# EAGLE design Test 2019 (EAGLE 9.4.0)
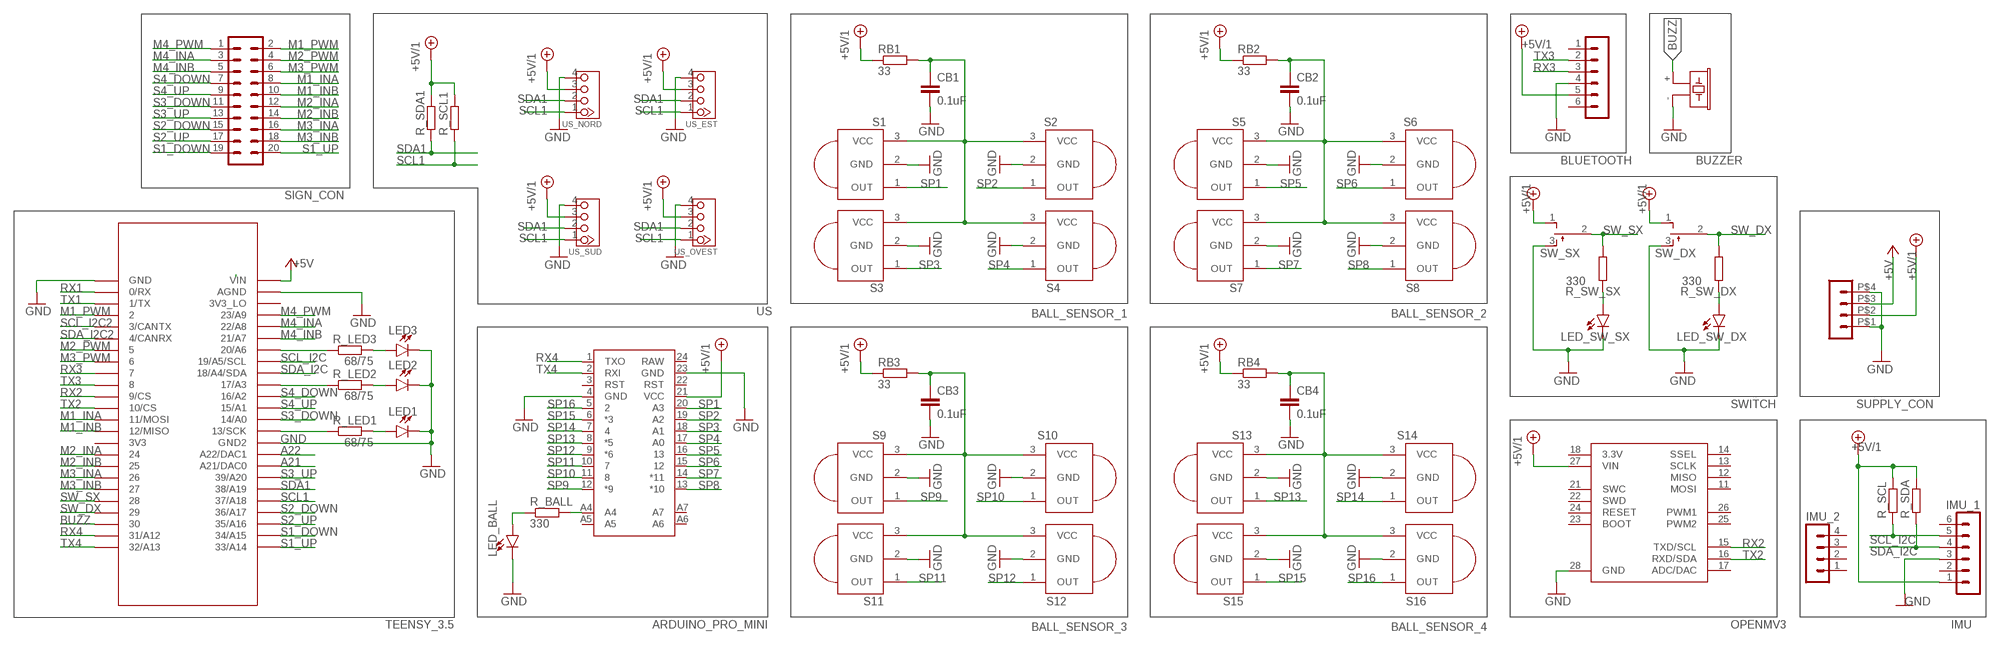
[diagram p0: schematic, sheet 1]

## Parts
ARDUINO_PRO_MINI  ARDUINO_PRO_MINI  [ARDUINO_PRO_MINI]
BLUETOOTH  MA06-1  [MA06-1]
BUZZER  F/CM12P  [F/CM12P]
CB1  0.1uF  C-EUC1206  [C1206]
CB2  0.1uF  C-EUC1206  [C1206]
CB3  0.1uF  C-EUC1206  [C1206]
CB4  0.1uF  C-EUC1206  [C1206]
IMU_1  MA06-1  [MA06-1]
IMU_2  MA04-1  [MA04-1]
LED1  LED3MM  [LED_3MM]
LED2  LED3MM  [LED_3MM]
LED3  LED3MM  [LED_3MM]
LED_BALL  LED3MM  [LED_3MM]
LED_SW_DX  LED3MM  [LED_3MM]
LED_SW_SX  LED3MM  [LED_3MM]
R_BALL  330  R-EU_R1206  [R1206]
R_LED1  68/75  R-EU_R0805  [R0805]
R_LED2  68/75  R-EU_R0805  [R0805]
R_LED3  68/75  R-EU_R0805  [R0805]
R_SCL  3.3k  R-EU_R0805  [R0805]
R_SCL1  3.3k  R-EU_R0805  [R0805]
R_SDA  3.3k  R-EU_R0805  [R0805]
R_SDA1  3.3k  R-EU_R0805  [R0805]
R_SW_DX  330  R-EU_R0805  [R0805]
R_SW_SX  330  R-EU_R0805  [R0805]
RB1  33  R-EU_R0805  [R0805]
RB2  33  R-EU_R0805  [R0805]
RB3  33  R-EU_R0805  [R0805]
RB4  33  R-EU_R0805  [R0805]
S1  PNA460XM  [PNA460XM]
S2  PNA460XM  [PNA460XM]
S3  PNA460XM  [PNA460XM]
S4  PNA460XM  [PNA460XM]
S5  PNA460XM  [PNA460XM]
S6  PNA460XM  [PNA460XM]
S7  PNA460XM  [PNA460XM]
S8  PNA460XM  [PNA460XM]
S9  PNA460XM  [PNA460XM]
S10  PNA460XM  [PNA460XM]
S11  PNA460XM  [PNA460XM]
S12  PNA460XM  [PNA460XM]
S13  PNA460XM  [PNA460XM]
S14  PNA460XM  [PNA460XM]
S15  PNA460XM  [PNA460XM]
S16  PNA460XM  [PNA460XM]
SIGN_CON  20V  [20V]
SUPPLY_CON  HEADER_POS4_43045-0412  [43045-0412]
SW_DX  TL38PO  [TL3XPO]
SW_SX  TL38PO  [TL3XPO]
TEENSY_3.5  TEENSY_3.5/3.6  [TEENSY_3.5/3.6]
U$2  OPENMV3  [OPENMV3]
US_EST  TWIG_2.0  [2.0_1X4]
US_NORD  TWIG_2.0  [2.0_1X4]
US_OVEST  TWIG_2.0  [2.0_1X4]
US_SUD  TWIG_2.0  [2.0_1X4]

## Nets
+5V: SUPPLY_CON.P$3 TEENSY_3.5.VIN
+5V/1: ARDUINO_PRO_MINI.21(VCC) BLUETOOTH.5 IMU_1.1 R_SCL1.2 R_SCL.2 R_SDA1.2 R_SDA.2 RB1.1 RB2.1 RB3.1 RB4.1 SUPPLY_CON.P$2 SW_DX.1(O) SW_SX.1(O) U$2.27(VIN) US_EST.3 US_NORD.3 US_OVEST.3 US_SUD.3
A21: TEENSY_3.5.21/DAC0(A21/DAC0)
A22: TEENSY_3.5.A22/DAC1
BUZZ: BUZZER.+ TEENSY_3.5.30
GND [Power]: ARDUINO_PRO_MINI.4(GND) ARDUINO_PRO_MINI.23(GND) BLUETOOTH.4 BUZZER.- CB1.2 CB2.2 CB3.2 CB4.2 IMU_1.3 LED1.K(C) LED2.K(C) LED3.K(C) LED_BALL.K(C) LED_SW_DX.K(C) LED_SW_SX.K(C) S1.2(GND) S2.2(GND) S3.2(GND) S4.2(GND) S5.2(GND) S6.2(GND) S7.2(GND) S8.2(GND) S9.2(GND) S10.2(GND) S11.2(GND) S12.2(GND) S13.2(GND) S14.2(GND) S15.2(GND) S16.2(GND) SUPPLY_CON.P$1 SUPPLY_CON.P$4 SW_DX.3(S) SW_SX.3(S) TEENSY_3.5.AGND TEENSY_3.5.GND TEENSY_3.5.GND2 U$2.28(GND) US_EST.4 US_NORD.4 US_OVEST.4 US_SUD.4
M1_INA: SIGN_CON.8 TEENSY_3.5.11/MOSI
M1_INB: SIGN_CON.10 TEENSY_3.5.12/MISO
M1_PWM: SIGN_CON.2 TEENSY_3.5.2
M2_INA: SIGN_CON.12 TEENSY_3.5.24
M2_INB: SIGN_CON.14 TEENSY_3.5.25
M2_PWM: SIGN_CON.4 TEENSY_3.5.5
M3_INA: SIGN_CON.16 TEENSY_3.5.26
M3_INB: SIGN_CON.18 TEENSY_3.5.27
M3_PWM: SIGN_CON.6 TEENSY_3.5.6
M4_INA: SIGN_CON.3 TEENSY_3.5.22/A8
M4_INB: SIGN_CON.5 TEENSY_3.5.21/A7
M4_PWM: SIGN_CON.1 TEENSY_3.5.23/A9
N$1: R_LED1.1 TEENSY_3.5.13/SCK
N$2: LED1.A R_LED1.2
N$3: LED_BALL.A R_BALL.1
N$4: ARDUINO_PRO_MINI.A4 R_BALL.2
N$5: LED_SW_SX.A R_SW_SX.1
N$6: LED2.A R_LED2.2
N$7: LED3.A R_LED3.2
N$8: R_LED3.1 TEENSY_3.5.20/A6
N$10: R_LED2.1 TEENSY_3.5.17/A3
N$11: LED_SW_DX.A R_SW_DX.1
POWER_BLOK_1: CB2.1 RB2.2 S5.3(VCC) S6.3(VCC) S7.3(VCC) S8.3(VCC)
POWER_BLOK_2: CB1.1 RB1.2 S1.3(VCC) S2.3(VCC) S3.3(VCC) S4.3(VCC)
POWER_BLOK_3: CB3.1 RB3.2 S9.3(VCC) S10.3(VCC) S11.3(VCC) S12.3(VCC)
POWER_BLOK_4: CB4.1 RB4.2 S13.3(VCC) S14.3(VCC) S15.3(VCC) S16.3(VCC)
RX1: TEENSY_3.5.0/RX
RX2: TEENSY_3.5.9/CS U$2.15(TXD/SCL)
RX3: BLUETOOTH.3 TEENSY_3.5.7
RX4: ARDUINO_PRO_MINI.1(TXO) TEENSY_3.5.31/A12
S1_DOWN: SIGN_CON.19 TEENSY_3.5.34/A15
S1_UP: SIGN_CON.20 TEENSY_3.5.33/A14
S2_DOWN: SIGN_CON.15 TEENSY_3.5.36/A17
S2_UP: SIGN_CON.17 TEENSY_3.5.35/A16
S3_DOWN: SIGN_CON.11 TEENSY_3.5.14/A0
S3_UP: SIGN_CON.13 TEENSY_3.5.39/A20
S4_DOWN: SIGN_CON.7 TEENSY_3.5.16/A2
S4_UP: SIGN_CON.9 TEENSY_3.5.15/A1
SCL1: R_SCL1.1 TEENSY_3.5.37/A18 US_EST.1 US_NORD.1 US_OVEST.1 US_SUD.1
SCL_I2C: IMU_1.5 R_SCL.1 TEENSY_3.5.19/A5/SCL
SCL_I2C2: TEENSY_3.5.3/CANTX
SDA1: R_SDA1.1 TEENSY_3.5.38/A19 US_EST.2 US_NORD.2 US_OVEST.2 US_SUD.2
SDA_I2C: IMU_1.4 R_SDA.1 TEENSY_3.5.18/A4/SDA
SDA_I2C2: TEENSY_3.5.4/CANRX
SP1: ARDUINO_PRO_MINI.20(A3) S1.1(OUT)
SP2: ARDUINO_PRO_MINI.19(A2) S2.1(OUT)
SP3: ARDUINO_PRO_MINI.18(A1) S3.1(OUT)
SP4: ARDUINO_PRO_MINI.17(A0) S4.1(OUT)
SP5: ARDUINO_PRO_MINI.16 S5.1(OUT)
SP6: ARDUINO_PRO_MINI.15 S6.1(OUT)
SP7: ARDUINO_PRO_MINI.14(*11) S7.1(OUT)
SP8: ARDUINO_PRO_MINI.13(*10) S8.1(OUT)
SP9: ARDUINO_PRO_MINI.12(*9) S9.1(OUT)
SP10: ARDUINO_PRO_MINI.11 S10.1(OUT)
SP11: ARDUINO_PRO_MINI.10 S11.1(OUT)
SP12: ARDUINO_PRO_MINI.9(*6) S12.1(OUT)
SP13: ARDUINO_PRO_MINI.8(*5) S13.1(OUT)
SP14: ARDUINO_PRO_MINI.7 S14.1(OUT)
SP15: ARDUINO_PRO_MINI.6(*3) S15.1(OUT)
SP16: ARDUINO_PRO_MINI.5 S16.1(OUT)
SW_DX: R_SW_DX.2 SW_DX.2(P) TEENSY_3.5.29
SW_SX: R_SW_SX.2 SW_SX.2(P) TEENSY_3.5.28
TX1: TEENSY_3.5.1/TX
TX2: TEENSY_3.5.10/CS U$2.16(RXD/SDA)
TX3: BLUETOOTH.2 TEENSY_3.5.8
TX4: ARDUINO_PRO_MINI.2(RXI) TEENSY_3.5.32/A13
Unconnected: ARDUINO_PRO_MINI.3(RST) ARDUINO_PRO_MINI.22(RST) ARDUINO_PRO_MINI.A5 ARDUINO_PRO_MINI.A6 ARDUINO_PRO_MINI.A7 BLUETOOTH.1 BLUETOOTH.6 IMU_1.2 IMU_1.6 IMU_2.1 IMU_2.2 IMU_2.3 IMU_2.4 TEENSY_3.5.3V3 TEENSY_3.5.3V3_LO U$2.11(MOSI) U$2.12(MISO) U$2.13(SCLK) U$2.14(SSEL) U$2.17(ADC/DAC) U$2.18(3.3V) U$2.21(SWC) U$2.22(SWD) U$2.23(BOOT) U$2.24(RESET) U$2.25(PWM2) U$2.26(PWM1)

## Notes on the sheet
- BUZZER
- BALL_SENSOR_1 | BALL_SENSOR_2
- US
- SWITCH
- BALL_SENSOR_3 | BALL_SENSOR_4
- TEENSY_3.5 | IMU

## Power pins joined to a net without a drawn wire
RAW: ARDUINO_PRO_MINI.24(RAW)

## Library data of the parts
ARDUINO_PRO_MINI = SparkFun-Boards:ARDUINO_PRO_MINI: SparkFun Pro Mini Pro Mini compatible footprint. Dimensions: 0.7 x 1.3" PCB Thickness: 0.8mm SparkFun Products: 3.3V/8MHz <https://www.sparkfun.com/products/11114> 5V/16MHz <https://www.sparkfun.com/products/11113>
BLUETOOTH IMU_1 = con-lstb:MA06-1: PIN HEADER; OC_FARNELL: unknown; OC_NEWARK: unknown
BUZZER = buzzer:F/CM12P: BUZZER Source: Buerklin; OC_FARNELL: unknown; OC_NEWARK: unknown
CB1-CB4 = rcl:C-EU: CAPACITOR, European symbol; SPICEPREFIX: C
IMU_2 = con-lstb:MA04-1: PIN HEADER; OC_FARNELL: unknown; OC_NEWARK: unknown
LED1-LED3 LED_BALL LED_SW_DX LED_SW_SX = SparkFun-LED:LED: LED (Generic) Standard schematic elements and footprints for 5mm, 3mm, 1206, and 0603 sized LEDs. Generic LEDs with no color specified.; PROD_ID: DIO-08794
R_BALL R_LED1-R_LED3 R_SCL R_SCL1 R_SDA R_SDA1 R_SW_DX R_SW_SX RB1-RB4 = rcl:R-EU_: RESISTOR, European symbol; SPICEPREFIX: R
S1-S16 = Adafruit:PNA460XM: IR 38KHz receiver PNA4602 and related receivers http://www.ladyada.net/library/pcb/eaglelibrary.html
SIGN_CON = con-harting-v-edit:20V: CONNECTOR; OC_FARNELL: unknown; OC_NEWARK: unknown
SUPPLY_CON = con-molex-micro-fit-3_0:HEADER_POS4_?: Molex - Micro-Fit 3.0 Series connector, 3.00mm (0.118") pitch header, 4 positions.
SW_DX SW_SX = switch:TL38PO: TINY SWITCH ON OFF MOM Source: http://www2.produktinfo.conrad.com/datenblaetter/700000-724999/705152-da-01-de-Subminiaturschalter_TL_36YO.pdf
TEENSY_3.5 = Teensy356:TEENSY_3.5/3.6
U$2 = openmv:OPENMV3
US_EST US_NORD US_OVEST US_SUD = CONNECTER:TWIG_2.0

## Net classes
0 default: width 0.203 mm, clearance 0.254 mm
1 Power: width 0.305 mm, clearance 0.406 mm
2 Power mot: width 1.93 mm

## Board
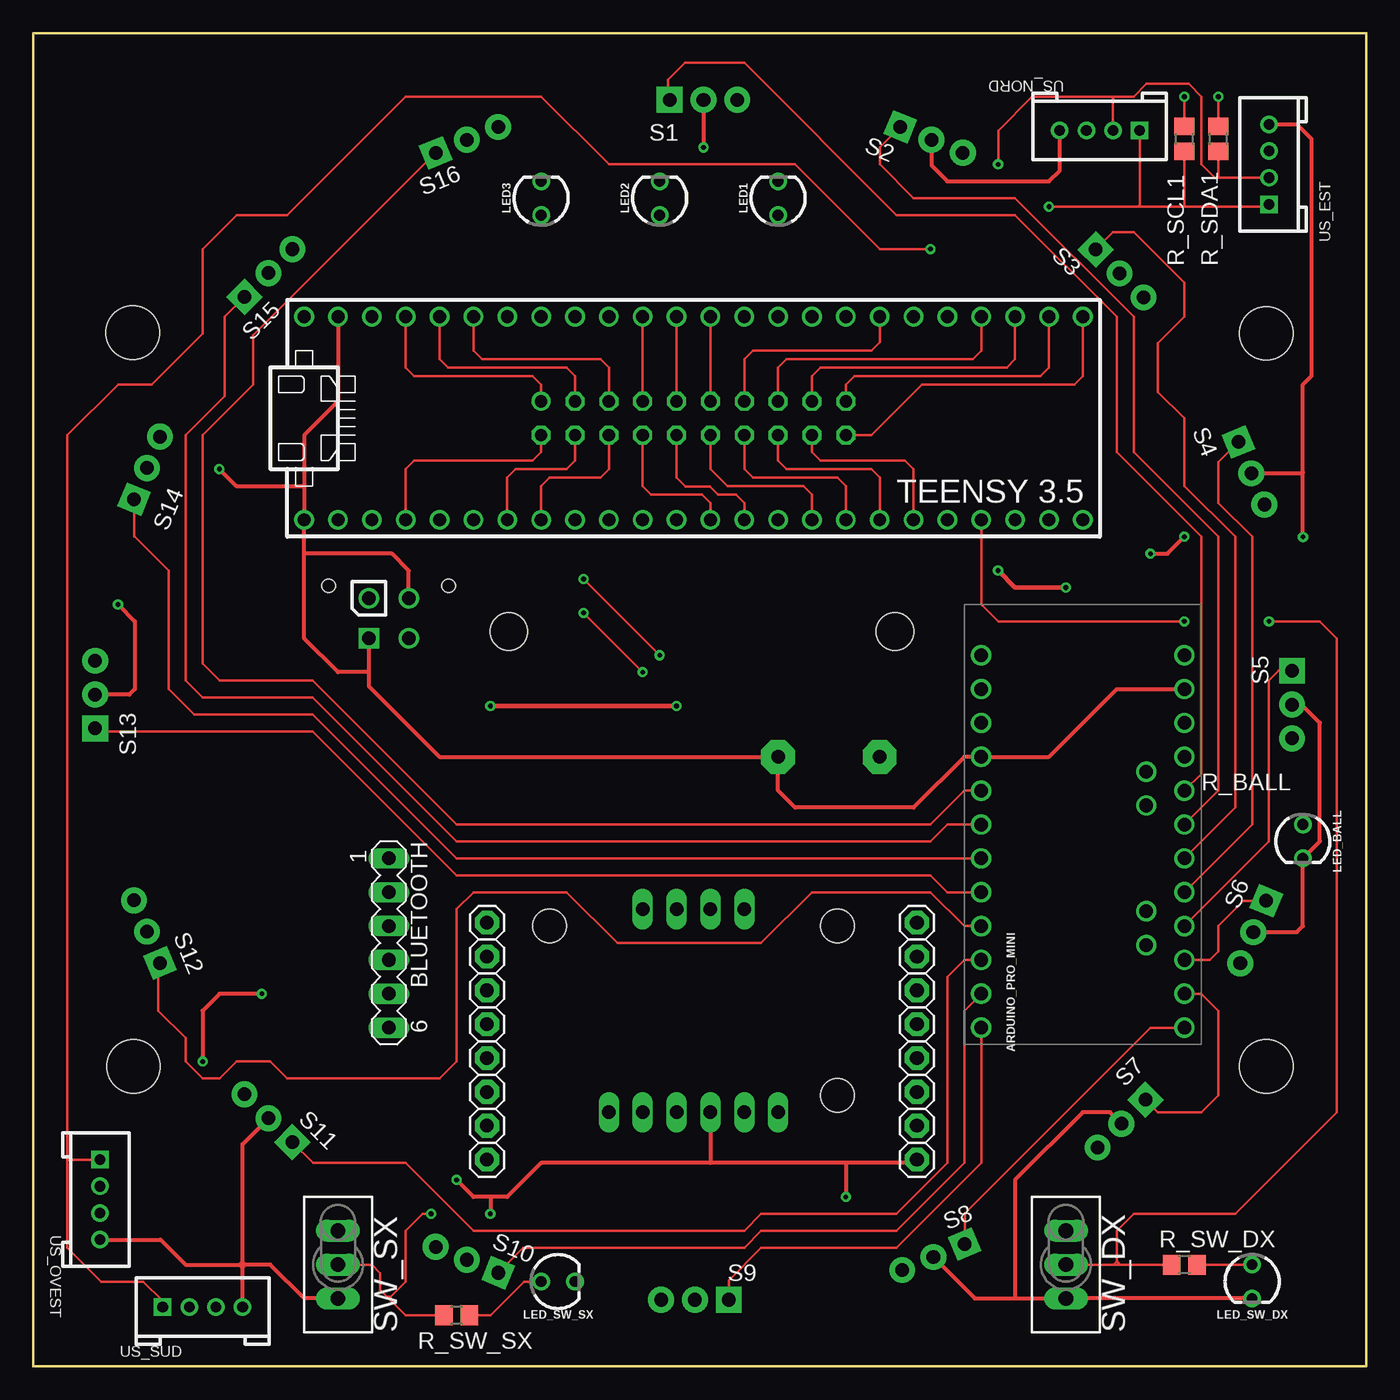
[diagram p1: board, top side]
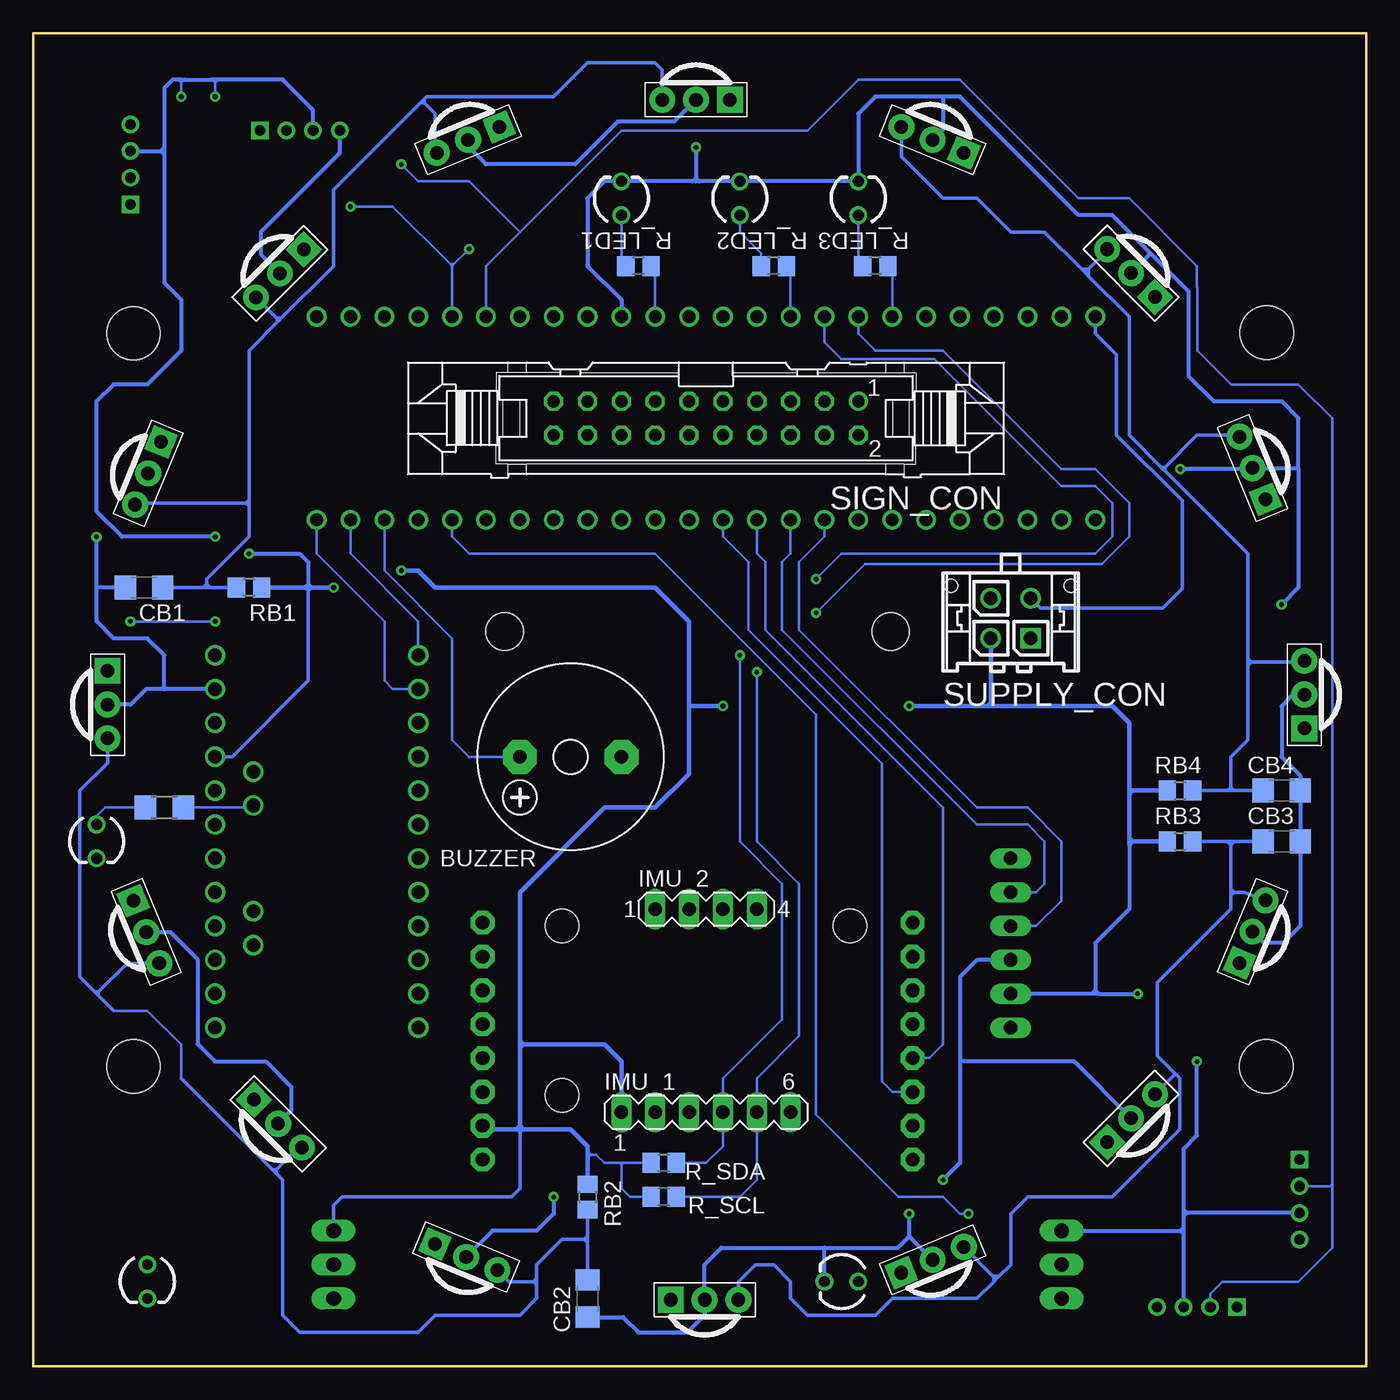
[diagram p2: board, bottom side, seen from below]

Size 100 x 100 mm. Coordinates in mm from the lower left corner, seen from the top.
Outline: 0,0 100,0 100,100 0,100 0,0
Copper layers (1*16): Top 0.035mm / dielectric 1.5mm / Bottom 0.035mm
Design rules "default *": minimum track width 6mil, minimum drill 0.35mm, track to track 5mil, track to pad 7mil, pad to pad 10mil, via to via 10mil, smd to smd 6mil, copper to edge 40mil, drill to drill 6mil, minimum pad ring 10mil, minimum via ring 8mil, stop-mask expansion 4mil, vias tented up to drill 0mil, thermal gap 10mil
Holes 2.8 mm at 64.64,55.12 35.68,55.12
Holes 2.54 mm at 60.33,33.02 38.73,33.02 60.33,20.32
Holes 4 mm at 92.5,77.5 7.46,77.54 92.5,22.5 7.5,22.5

### Footprints (pad centres in the part's own frame; a part is rotated, then mirrored left to right if it is on the bottom)
ARDUINO_PRO_MINI = drill 1.016: 1 -7.62,12.7; 2 -7.62,10.16; 3 -7.62,7.62; 4 -7.62,5.08; 5 -7.62,2.54; 6 -7.62,0; 7 -7.62,-2.54; 8 -7.62,-5.08; 9 -7.62,-7.62; 10 -7.62,-10.16; 11 -7.62,-12.7; 12 -7.62,-15.24; 13 7.62,-15.24; 14 7.62,-12.7; 15 7.62,-10.16; 16 7.62,-7.62; 17 7.62,-5.08; 18 7.62,-2.54; 19 7.62,0; 20 7.62,2.54; 21 7.62,5.08; 22 7.62,7.62; 23 7.62,10.16; 24 7.62,12.7; A4 4.763,1.429; A5 4.763,3.969; A6 4.763,-9.049; A7 4.763,-6.509
MA06-1 = drill 1.016 long: 1 -6.35,0; 2 -3.81,0; 3 -1.27,0; 4 1.27,0; 5 3.81,0; 6 6.35,0
F/CM12P = drill 1.016 pad 2.54 octagon: + 3.81,0; - -3.81,0
C1206 = smd 1.6 x 1.8: 1 -1.4,0; 2 1.4,0
MA04-1 = drill 1.016 long: 1 -3.81,0; 2 -1.27,0; 3 1.27,0; 4 3.81,0
LED_3MM = drill 0.813: A -1.27,0; K 1.27,0
R1206 = smd 1.6 x 1.803: 1 -1.422,0; 2 1.422,0
R0805 = smd 1.3 x 1.5: 1 -0.95,0; 2 0.95,0
PNA460XM = drill 1.016 pad 1.93 square: 1 -2.54,0 | drill 1.016 pad 1.93: 2 0,0; 3 2.54,0
20V = drill 0.914: 1 -11.43,-1.27 | drill 0.914 octagon: 2 -11.43,1.27; 3 -8.89,-1.27; 4 -8.89,1.27; 5 -6.35,-1.27; 6 -6.35,1.27; 7 -3.81,-1.27; 8 -3.81,1.27; 9 -1.27,-1.27; 10 -1.27,1.27; 11 1.27,-1.27; 12 1.27,1.27; 13 3.81,-1.27; 14 3.81,1.27; 15 6.35,-1.27; 16 6.35,1.27; 17 8.89,-1.27; 18 8.89,1.27; 19 11.43,-1.27; 20 11.43,1.27
43045-0412 = drill 1.02 square: P$1 1.5,0 | drill 1.02: P$2 -1.5,0; P$3 1.5,3; P$4 -1.5,3 | hole 1.02: 4.5,3.94; -4.5,3.94
TL3XPO = drill 1.1 pad 1.422 long: 1 -2.54,0; 2 0,0; 3 2.54,0
TEENSY_3.5/3.6 = drill 0.965: 0/RX -25.4,-7.62; 1/TX -22.86,-7.62; 2 -20.32,-7.62; 3/CANTX -17.78,-7.62; 3V3 7.62,-7.62; 3V3_LO -22.86,7.62; 4/CANRX -15.24,-7.62; 5 -12.7,-7.62; 6 -10.16,-7.62; 7 -7.62,-7.62; 8 -5.08,-7.62; 9/CS -2.54,-7.62; 10/CS 0,-7.62; 11/MOSI 2.54,-7.62; 12/MISO 5.08,-7.62; 13/SCK 5.08,7.62; 14/A0 2.54,7.62; 15/A1 0,7.62; 16/A2 -2.54,7.62; 17/A3 -5.08,7.62; 18/A4/SDA -7.62,7.62; 19/A5/SCL -10.16,7.62; 20/A6 -12.7,7.62; 21/A7 -15.24,7.62; 21/DAC0 12.7,7.62; 22/A8 -17.78,7.62; 23/A9 -20.32,7.62; 24 10.16,-7.62; 25 12.7,-7.62; 26 15.24,-7.62; 27 17.78,-7.62; 28 20.32,-7.62; 29 22.86,-7.62; 30 25.4,-7.62; 31/A12 27.94,-7.62; 32/A13 30.48,-7.62; 33/A14 30.48,7.62; 34/A15 27.94,7.62; 35/A16 25.4,7.62; 36/A17 22.86,7.62; 37/A18 20.32,7.62; 38/A19 17.78,7.62; 39/A20 15.24,7.62; A22/DAC1 10.16,7.62; AGND -25.4,7.62; GND -27.94,-7.62; GND2 7.62,7.62; VIN -27.94,7.62
OPENMV3 = drill 1.016 pad 1.778 octagon: 11 1.651,19.304; 12 1.651,16.764; 13 1.651,14.224; 14 1.651,11.684; 15 1.651,9.144; 16 1.651,6.604; 17 1.651,4.064; 18 1.651,1.524; 21 33.909,19.304; 22 33.909,16.764; 23 33.909,14.224; 24 33.909,11.684; 25 33.909,9.144; 26 33.909,6.604; 27 33.909,4.064; 28 33.909,1.524
2.0_1X4 = drill 0.8 pad 1.27 square: 1 -3,0 | drill 0.8 pad 1.27: 2 -1,0; 3 1,0; 4 3,0

### Placement (x,y rotation side)
ARDUINO_PRO_MINI  78.74,40.64 0 top
BLUETOOTH  26.67,31.75 270 top
BUZZER  59.69,45.72 180 bottom
CB1  91.69,58.42 180 bottom
CB2  58.42,5.08 270 bottom
CB3  6.35,39.37 0 bottom
CB4  6.35,43.18 0 bottom
IMU_1  49.53,19.05 0 bottom
IMU_2  49.53,34.29 0 bottom
LED1  55.88,87.63 90 top
LED2  46.99,87.63 90 top
LED3  38.1,87.63 90 top
LED_BALL  95.25,39.37 270 top
LED_SW_DX  91.44,6.35 270 top
LED_SW_SX  39.37,6.35 0 top
R_BALL  90.17,41.91 0 bottom
R_LED1  54.61,82.55 180 bottom
R_LED2  44.45,82.55 180 bottom
R_LED3  36.83,82.55 180 bottom
R_SCL  52.7,12.7 180 bottom
R_SCL1  86.36,92.08 90 top
R_SDA  52.7,15.24 180 bottom
R_SDA1  88.9,92.08 90 top
R_SW_DX  86.36,7.62 180 top
R_SW_SX  31.75,3.81 180 top
RB1  83.82,58.42 180 bottom
RB2  58.42,12.7 270 bottom
RB3  13.97,39.37 0 bottom
RB4  13.97,43.18 0 bottom
S1  50.28,95.01 180 bottom
S2  67.39,92.01 202.5 bottom
S3  81.5,81.99 225 bottom
S4  91.39,66.99 247.5 bottom
S5  94.43,49.64 270 bottom
S6  91.53,32.57 292.5 bottom
S7  81.64,18.19 315 bottom
S8  67.53,8.19 337.5 bottom
S9  49.64,4.98 0 bottom
S10  32.53,7.98 22.5 bottom
S11  17.64,18.6 45 bottom
S12  8.53,32.6 67.5 bottom
S13  4.64,50.39 90 bottom
S14  8.53,67.39 112.5 bottom
S15  17.64,82.01 135 bottom
S16  32.53,92.01 157.5 bottom
SIGN_CON  49.53,71.12 180 bottom
SUPPLY_CON  26.67,54.61 0 bottom
SW_DX  77.47,7.62 270 top
SW_SX  22.86,7.62 270 top
TEENSY_3.5  48.26,71.12 0 top
U$2  32.38,13.97 0 top
US_EST  92.71,90.17 90 top
US_NORD  80.01,92.71 180 top
US_OVEST  5,12.5 270 top
US_SUD  12.7,4.45 0 top

### Tracks (layer width: path | path; a pad name or v marks a point on that pad's centre or on a via)
+5V
  Bottom 0.254: TEENSY_3.5.VIN 20.32,77.47 18.73,75.88 18.73,69.85 13.81,64.93 13.81,58.33 15.24,56.9 24.46,56.9 SUPPLY_CON.P$3
+5V/1  (via drill 0.35)
  Top 0.203: v88.9,95.25 R_SDA1.2 | R_SCL1.2 v86.36,95.25
  Top 0.305: v83.82,60.96 85.09,60.96 v86.36,62.23 | v17.14,27.94 13.97,27.94 12.7,26.67 v12.7,22.86
  Top 0.356: v72.39,59.69 73.66,58.42 v77.47,58.42 | v34.29,49.53 v48.26,49.53
  Bottom 0.203: 58.17,15.88 57.78,15.88 57.15,15.24 56.01,15.24 | 58.42,15.88 58.17,15.88 | R_SDA.2 55.75,15.24 | 55.75,15.24 55.88,15.24 | 55.88,15.24 56.01,15.24 | 58.17,15.88 58.42,16.13 | 58.17,15.88 58.29,15.75 58.42,15.75 | 55.88,15.24 55.88,15.11 | 55.88,15.11 55.88,13.34 55.24,12.7 R_SCL.2 | 55.75,15.24 55.88,15.11 | 55.88,15.11 56.01,15.24 | v88.9,95.25 88.9,96.27 | 88.9,96.27 88.9,96.52 | v86.36,95.25 86.36,96.27 | 86.36,96.52 86.36,96.27 | 85.98,96.52 86.11,96.52 86.36,96.27 | 86.36,96.27 86.61,96.52 | 88.65,96.52 88.9,96.27 | 88.9,96.27 89.15,96.52
  Bottom 0.254: ARDUINO_PRO_MINI.21 85.09,45.72 79.38,51.44 79.38,58.17 | 79.38,58.17 79.38,58.42 79.38,58.67 | 79.38,58.17 79.25,58.29 79.25,58.42 79.25,58.55 | 79.38,58.17 79.5,58.29 79.5,58.42 79.5,58.55 | 17.78,45.72 17.78,43.43 | 17.78,43.18 17.78,43.43 | 17.53,43.18 17.78,43.43 | SW_DX.1 77.47,12.06 76.83,12.7 64.14,12.7 63.5,13.34 63.5,17.53 | 63.5,17.78 63.5,17.53 | 63.25,17.78 63.5,17.53 | 63.5,17.53 63.75,17.78
  Bottom 0.305: v83.82,60.96 80.01,60.96 79.38,60.33 79.38,58.67 | 79.38,58.67 79.25,58.55 | 79.38,58.67 79.5,58.55 | 17.78,39.37 17.78,34.29 20.32,31.75 20.32,28.19 | 20.32,27.94 20.32,28.19 | 20.07,27.94 20.32,27.94 | 20.32,27.94 20.57,27.94 | 20.57,27.94 BLUETOOTH.5 | 20.07,27.94 20.32,28.19 | 20.32,28.19 20.57,27.94 | v86.36,62.23 93.34,62.23 95.25,64.14 95.25,72.39 93.98,73.66 91.44,73.66 88.9,76.2 88.9,80.01 90.17,81.28 90.17,90.93 | US_NORD.3 79.01,94.25 81.28,96.52 85.98,96.52 86.36,96.52 86.61,96.52 88.65,96.52 88.9,96.52 89.15,96.52 89.53,96.52 90.17,95.89 90.17,91.44 | 90.17,91.44 90.17,91.19 | 90.17,91.19 90.17,90.93 | US_EST.3 90.42,91.17 | 90.41,91.17 90.19,91.17 90.17,91.19 | 90.17,91.44 90.42,91.19 90.42,91.17 | 90.17,90.93 90.41,91.17 | 90.41,91.17 90.42,91.17 | v12.7,22.86 12.7,17.31 13.7,16.31 13.7,11.74 | 20.07,27.94 v17.14,27.94 | US_SUD.3 13.7,9.91 | 13.7,9.91 13.7,10.16 | 13.7,10.16 13.7,10.41 | 13.7,10.41 13.7,11.3 | 13.7,11.3 13.7,11.43 | 13.7,11.43 13.7,11.74 | US_OVEST.3 13.46,11.5 | 13.46,11.5 13.63,11.5 13.7,11.43 | 13.7,11.74 13.46,11.5 | 13.46,11.5 13.66,11.3 13.7,11.3 | SW_SX.1 13.95,10.16 | 13.95,10.16 13.7,10.16 | 13.7,10.41 13.95,10.16 | 13.95,10.16 13.7,9.91
  Bottom 0.356: 17.78,43.18 17.53,43.18 | 17.53,43.18 RB4.1 | 17.78,39.37 17.78,39.12 17.53,39.37 | 17.78,39.37 17.78,39.62 | 17.78,39.62 17.78,42.93 | 17.78,43.18 17.78,42.93 | 17.53,39.37 17.78,39.37 | 17.53,39.37 RB3.1 | 17.78,42.93 17.53,43.18 | 17.53,39.37 17.78,39.62 | 63.5,24.38 63.5,24.13 | 63.5,24.13 63.5,23.88 | IMU_1.1 55.88,22.86 57.15,24.13 63.25,24.13 | 63.5,24.13 63.25,24.13 | 63.25,24.13 63.5,24.38 | 63.25,24.13 63.5,23.88 | 50.8,49.53 50.8,55.88 53.34,58.42 69.85,58.42 71.12,59.69 v72.39,59.69 | 50.8,49.53 50.8,44.45 53.34,41.91 57.15,41.91 63.5,35.56 63.5,24.38 | SUPPLY_CON.P$2 28.17,49.76 | 28.17,49.76 28.17,49.53 | v77.47,58.42 79.25,58.42 79.38,58.42 79.5,58.42 RB1.1 | RB2.1 58.42,15.75 58.42,15.88 58.42,16.13 58.42,16.51 59.69,17.78 63.25,17.78 | 63.5,17.78 63.25,17.78 | 63.5,17.78 63.75,17.78 | 63.75,17.78 66.04,17.78 U$2.27 | 63.5,23.88 63.5,18.03 | 63.5,17.78 63.5,18.03 | 63.5,18.03 63.25,17.78 | 63.5,18.03 63.75,17.78 | 17.78,43.18 17.78,45.72 17.78,48.26 19.05,49.53 27.94,49.53 | 28.17,49.53 27.94,49.53 | 28.4,49.53 28.17,49.53 | 28.17,49.76 27.94,49.53 | 28.17,49.76 28.4,49.53 | 28.4,49.53 v34.29,49.53 | 50.8,49.53 v48.26,49.53
BUZZ
  Bottom 0.203: TEENSY_3.5.30 73.66,59.69 68.58,54.61 68.58,46.99 67.31,45.72 BUZZER.+
GND  (via drill 0.35)
  Top 0.305: SUPPLY_CON.P$4 28.17,59.69 26.9,60.96 20.32,60.96 | TEENSY_3.5.AGND 22.86,72.39 20.32,69.85 20.32,66.04 | 20.32,66.04 TEENSY_3.5.GND 20.32,60.96 | v13.95,67.31 15.22,66.04 20.32,66.04 | S1.2 v50.28,91.44 | S2.2 67.39,90.09 68.58,88.9 76.2,88.9 77.01,89.71 US_NORD.4 | v6.35,57.15 7.62,55.88 7.62,50.8 7.21,50.39 S13.2 | v31.75,13.97 33.02,12.7 34.29,12.7 | IMU_1.3 50.8,15.24 | 34.29,12.7 35.56,12.7 38.1,15.24 50.8,15.24 | U$2.28 66.04,15.24 60.96,15.24 | 60.96,15.24 50.8,15.24 | 34.29,12.7 v34.29,11.43 | S7.2 80.78,19.05 78.74,19.05 73.66,13.97 73.66,5.08 | 73.66,5.08 SW_DX.3 LED_SW_DX.K | S8.2 70.64,5.08 73.66,5.08 | ARDUINO_PRO_MINI.23 81.28,50.8 76.2,45.72 ARDUINO_PRO_MINI.4 69.85,45.72 66.04,41.91 57.15,41.91 55.88,43.18 BUZZER.- 30.48,45.72 25.17,51.03 25.17,52.07 | SUPPLY_CON.P$1 25.17,52.07 | 60.96,15.24 v60.96,12.7 | 25.17,52.07 22.86,52.07 20.32,54.61 20.32,60.96 | S6.2 94.8,32.57 95.25,33.02 LED_BALL.K 96.52,39.37 96.52,48.26 95.14,49.64 S5.2 | v95.26,62.22 v95.25,62.23 95.25,67.06 | S4.2 95.18,66.99 95.25,67.06 | US_EST.4 94.79,93.17 95.89,92.08 95.89,74.3 95.25,73.66 95.25,67.06 | US_SUD.4 15.7,7.49 | 15.7,7.49 15.7,7.62 | 15.7,7.62 15.7,7.75 | 15.7,7.75 15.7,16.66 S11.2 | SW_SX.3 20.32,5.08 17.78,7.62 15.88,7.62 | 15.7,7.62 15.88,7.62 | US_OVEST.4 9.55,9.5 11.43,7.62 15.49,7.62 | 15.7,7.62 15.49,7.62 | 15.49,7.62 15.62,7.75 15.7,7.75 | 15.49,7.62 15.62,7.49 15.7,7.49 | 15.88,7.62 15.75,7.75 15.7,7.75 | 15.7,7.49 15.75,7.49 15.88,7.62
  Bottom 0.305: v13.95,67.31 8.61,67.31 S14.2 5.16,67.39 5.08,67.31 | 31.75,95.25 30.48,95.25 21.59,86.36 19.05,86.36 16.26,83.57 | 31.75,95.25 36.83,95.25 38.1,93.98 LED3.K LED2.K 50.04,88.9 | 50.04,88.9 50.29,88.9 | 50.29,88.9 50.52,88.9 | 50.52,88.9 LED1.K 57.15,88.9 58.42,87.63 58.42,82.55 55.88,80.01 TEENSY_3.5.GND2 | S16.2 31.75,92.79 31.75,95.25 | v50.28,91.44 50.28,89.14 | 50.28,89.14 50.28,88.91 50.29,88.9 | 50.04,88.9 50.28,89.14 | 50.28,89.14 50.52,88.9 | S1.2 51.92,93.37 56.15,93.37 59.35,90.17 66.04,90.17 67.39,91.52 S2.2 | v6.35,57.15 5.08,58.42 5.08,67.31 | BLUETOOTH.4 29.21,30.48 30.48,29.21 30.48,22.86 | S11.2 21.9,22.86 30.48,22.86 | v31.75,13.97 30.48,15.24 30.48,22.86 | v34.29,11.43 34.29,9.74 | S10.2 34.18,9.63 | 34.18,9.63 34.29,9.74 | 34.29,9.74 34.4,9.63 | 34.18,9.63 34.4,9.63 | 40.64,8.89 48.37,8.89 49.64,7.62 S9.2 49.64,3.81 50.91,2.54 54.61,2.54 55.75,3.68 CB2.2 | 40.64,8.89 35.14,8.89 34.4,9.63 | LED_SW_SX.K 40.64,8.89 | S5.2 92.71,49.64 91.55,50.8 90.17,50.8 | v60.96,12.7 60.96,11.43 62.23,10.16 65.56,10.16 S8.2 | S6.2 89.72,32.57 87.68,30.53 87.68,24.18 86.36,22.86 82.55,22.86 80.64,20.95 80.64,19.18 S7.2 | ARDUINO_PRO_MINI.23 90.17,50.8 | 90.17,50.8 90.17,53.34 91.44,54.61 93.98,54.61 95.26,55.89 95.26,58.42 | 95.26,58.42 v95.26,62.22 | CB1.2 95.26,58.42 | S3.2 82.94,83.43 82.94,85.09 77.01,91.02 US_NORD.4 | 5.08,67.31 5.08,71.12 6.35,72.39 11.43,72.39 13.34,74.3 13.34,80.64 16.26,83.57 | S15.2 16.26,83.39 16.26,83.57 | S13.2 5.49,50.39 6.35,49.53 6.35,45.72 4.95,44.32 CB4.2 CB3.2 4.95,33.02 6.22,31.75 7.68,31.75 S12.2
M1_INA
  Top 0.203: SIGN_CON.8 45.72,66.04 46.35,65.41 50.16,65.41 50.8,64.77 TEENSY_3.5.11/MOSI
M1_INB
  Top 0.203: TEENSY_3.5.12/MISO 53.34,64.77 52.7,65.41 51.35,65.41 50.76,66 48.94,66 48.26,66.67 SIGN_CON.10
M1_PWM
  Top 0.203: SIGN_CON.2 38.1,68.58 37.47,67.94 28.57,67.94 27.94,67.31 TEENSY_3.5.2
M2_INA
  Top 0.203: SIGN_CON.12 50.8,67.31 52.07,66.04 57.78,66.04 58.42,65.41 TEENSY_3.5.24
M2_INB
  Top 0.203: SIGN_CON.14 53.34,67.31 53.98,66.67 60.33,66.67 60.96,66.04 TEENSY_3.5.25
M2_PWM
  Top 0.203: TEENSY_3.5.5 35.56,66.67 36.2,67.31 40.01,67.31 40.64,67.94 SIGN_CON.4
M3_INA
  Top 0.203: SIGN_CON.16 55.88,67.94 56.52,67.31 62.87,67.31 63.5,66.67 TEENSY_3.5.26
M3_INB
  Top 0.203: SIGN_CON.18 58.42,68.58 59.05,67.94 64.77,67.94 65.41,67.94 66.04,67.31 TEENSY_3.5.27
M3_PWM
  Top 0.203: SIGN_CON.6 43.18,67.31 42.55,66.67 38.73,66.67 38.1,66.04 TEENSY_3.5.6
M4_INA
  Top 0.203: TEENSY_3.5.22/A8 30.48,75.56 31.11,74.93 40.01,74.93 40.64,74.3 SIGN_CON.3
M4_INB
  Top 0.203: TEENSY_3.5.21/A7 33.02,76.2 33.66,75.56 42.55,75.56 43.18,74.93 SIGN_CON.5
M4_PWM
  Top 0.203: SIGN_CON.1 38.1,73.66 37.47,74.3 28.57,74.3 27.94,74.93 TEENSY_3.5.23/A9
N$1
  Bottom 0.203: TEENSY_3.5.13/SCK 53.34,82.23 R_LED1.1
N$2
  Bottom 0.203: LED1.A 55.88,82.87 R_LED1.2
N$3
  Bottom 0.203: R_BALL.1 94.61,41.91 95.25,41.27 LED_BALL.A
N$4
  Bottom 0.203: R_BALL.2 83.66,41.91 ARDUINO_PRO_MINI.A4
N$5
  Top 0.203: LED_SW_SX.A 36.83,6.35 34.29,3.81 R_SW_SX.1
N$6
  Bottom 0.203: LED2.A 46.99,85.09 45.4,83.5 R_LED2.2
N$7
  Bottom 0.203: LED3.A 38.1,82.87 R_LED3.2
N$8
  Bottom 0.203: TEENSY_3.5.20/A6 35.56,82.23 R_LED3.1
N$10
  Bottom 0.203: TEENSY_3.5.17/A3 43.18,82.23 R_LED2.1
N$11
  Top 0.203: R_SW_DX.1 LED_SW_DX.A
POWER_BLOK_1
  Bottom 0.203: 93.98,26.67 91.44,26.67 88.9,24.13 88.9,21.59
  Bottom 0.254: RB2.2 58.42,9.78 | 58.42,9.78 58.42,9.53 | 58.42,9.53 58.42,9.27 | 58.42,9.27 CB2.1 | S5.3 94.43,45.27 96.52,43.18 96.52,29.21 95.38,28.07 | 62.23,6.1 62.23,5.08 63.5,3.81 69.85,3.81 71.12,2.54 80.01,2.54 81.28,3.81 81.28,13.97 81.79,14.48 | 62.23,6.1 62.23,6.35 | 62.23,6.35 62.23,6.6 | 62.23,6.6 62.23,7.62 60.33,9.53 58.67,9.53 | 95.38,28.07 95.25,27.94 | 95.25,27.94 95.12,27.81 | 95.12,27.81 93.98,26.67 | 88.9,21.59 82.04,14.73 | 82.04,14.73 81.92,14.61 | 81.92,14.61 81.79,14.48 | 58.42,9.53 58.67,9.53 | 58.67,9.53 58.42,9.27 | 58.67,9.53 58.42,9.78 | S8.3 64.31,6.35 62.48,6.35 | 62.23,6.35 62.48,6.35 | 62.48,6.35 62.23,6.6 | 62.48,6.35 62.23,6.1 | 81.92,14.61 81.79,14.73 | 81.79,14.73 80.13,16.39 S7.3 | 81.79,14.73 81.79,14.48 | 81.79,14.73 82.04,14.73 | S6.3 92.97,30.22 95.12,28.07 | 95.12,28.07 95.25,27.94 | 95.38,28.07 95.12,28.07 | 95.12,28.07 95.12,27.81
POWER_BLOK_2
  Bottom 0.254: RB1.2 86.74,58.42 | 86.74,58.42 87,58.42 | 87,58.42 87.25,58.42 | 87.25,58.42 CB1.1 | S1.3 52.82,97.27 53.34,97.79 58.42,97.79 60.96,95.25 70.48,95.25 70.67,95.06 | S2.3 69.85,91.15 69.85,93.98 70.67,94.81 | 83.82,64.52 83.82,62.23 87,59.05 87,58.67 | 83.82,64.52 83.82,64.77 | 83.82,65.02 83.82,76.2 81.69,78.33 | 83.82,65.02 83.82,64.77 | S4.3 92.23,64.77 84.07,64.77 | 83.82,64.77 84.07,64.77 | 84.07,64.77 83.82,65.02 | 84.07,64.77 83.82,64.52 | 70.67,95.06 70.8,94.93 | 70.93,94.81 70.8,94.93 | 70.8,94.93 70.67,94.81 | 70.93,94.81 70.67,94.81 | 70.67,95.06 70.67,94.81 | 87,58.42 87,58.67 | 87,58.67 86.74,58.42 | 87,58.67 87.25,58.42 | 81.41,78.61 77.47,82.55 77.47,88.27 70.93,94.81 | 81.41,78.61 81.53,78.49 | 81.53,78.49 81.69,78.33 | S3.3 81.69,78.59 | 81.69,78.59 81.59,78.49 81.53,78.49 | 81.69,78.59 81.69,78.33 | 81.69,78.59 81.66,78.61 81.41,78.61
POWER_BLOK_3
  Bottom 0.254: RB3.2 10.41,39.37 | 10.41,39.37 10.16,39.37 | 10.16,39.37 9.91,39.37 | 9.91,39.37 CB3.1 | 10.16,39.37 10.16,39.12 | 10.16,35.31 10.16,34.29 15.24,29.21 15.67,28.78 15.67,23.29 15.24,22.86 14.4,22.02 | 10.16,35.31 10.16,35.56 | 10.16,35.56 10.16,35.81 | 10.16,35.81 10.16,39.12 | S9.3 47.1,6.35 45.83,7.62 44.45,7.62 43.18,6.35 43.18,5.08 41.91,3.81 36.83,3.81 35.56,5.08 29.21,5.08 27.94,6.35 | 9.91,39.37 10.16,39.12 | 10.16,39.12 10.41,39.37 | S12.3 9.14,35.56 9.91,35.56 | 10.16,35.56 9.91,35.56 | 9.91,35.56 10.16,35.81 | 9.91,35.56 10.16,35.31 | 27.56,6.73 26.67,7.62 26.67,11.43 25.4,12.7 19.05,12.7 13.97,17.78 13.97,21.59 14.22,21.84 | 27.56,6.73 27.75,6.54 | 27.75,6.54 27.94,6.35 | S10.3 27.95,6.72 | 27.94,6.71 27.77,6.54 27.75,6.54 | 27.56,6.73 27.94,6.73 27.95,6.72 | 27.94,6.35 27.94,6.71 | 27.94,6.71 27.95,6.72 | 14.4,22.02 14.22,21.84 | S11.3 14.4,21.84 | 14.4,21.84 14.22,21.84 | 14.4,21.84 14.4,22.02
POWER_BLOK_4
  Bottom 0.254: RB4.2 10.41,43.18 | 10.41,43.18 10.16,43.18 | 10.16,43.18 9.91,43.18 | 9.91,43.18 CB4.1 | 10.16,43.18 10.16,43.43 | 10.16,43.43 10.16,45.72 8.89,46.99 8.89,52.58 | 8.89,52.58 8.89,52.83 | 8.89,52.83 8.89,53.09 | 8.89,53.09 8.89,60.96 15.11,67.18 | 8.89,52.83 8.64,52.83 | 8.64,52.83 4.74,52.83 S13.3 | 8.64,52.83 8.89,53.09 | 8.64,52.83 8.89,52.58 | 21.34,82.3 24.13,85.09 26.67,85.09 29.21,87.63 31.75,87.63 34.88,90.76 S16.3 | 21.34,82.3 21.08,82.04 | 21.08,82.04 20.83,81.79 | 20.83,81.79 17.78,78.74 17.78,69.85 15.37,67.44 | S14.3 9.62,69.85 12.7,69.85 15.11,67.44 | 21.08,82.04 20.83,82.3 | 20.83,82.3 19.44,83.69 S15.3 | 20.83,82.3 21.34,82.3 | 20.83,82.3 20.83,81.79 | 9.91,43.18 10.16,43.43 | 10.16,43.43 10.41,43.18 | 15.37,67.44 15.24,67.31 | 15.24,67.31 15.11,67.18 | 15.24,67.31 15.11,67.44 | 15.37,67.44 15.11,67.44 | 15.11,67.44 15.11,67.18
RX2
  Bottom 0.203: TEENSY_3.5.9/CS 45.72,60.96 45.09,60.33 45.09,55.24 31.75,41.91 31.75,24.13 32.77,23.11 U$2.15
RX3
  Bottom 0.203: BLUETOOTH.3 24.77,33.02 22.86,34.92 22.86,39.37 25.4,41.91 29.21,41.91 42.55,55.24 42.55,60.33 40.64,62.23 TEENSY_3.5.7
RX4
  Bottom 0.203: TEENSY_3.5.31/A12 76.2,60.96 71.12,55.88 ARDUINO_PRO_MINI.1
S1_DOWN
  Top 0.203: SIGN_CON.19 60.96,73.66 61.59,74.3 75.56,74.3 76.2,74.93 TEENSY_3.5.34/A15
S1_UP
  Top 0.203: SIGN_CON.20 62.87,69.85 66.67,73.66 78.11,73.66 78.74,74.3 TEENSY_3.5.33/A14
S2_DOWN
  Top 0.203: SIGN_CON.15 55.88,74.93 56.52,75.56 70.48,75.56 71.12,76.2 TEENSY_3.5.36/A17
S2_UP
  Top 0.203: SIGN_CON.17 58.42,74.3 59.05,74.93 73.03,74.93 73.66,75.56 TEENSY_3.5.35/A16
S3_DOWN
  Top 0.203: SIGN_CON.11 TEENSY_3.5.14/A0
S3_UP
  Top 0.203: TEENSY_3.5.39/A20 63.5,76.83 62.87,76.2 53.98,76.2 53.34,75.56 SIGN_CON.13
S4_DOWN
  Top 0.203: SIGN_CON.7 TEENSY_3.5.16/A2
S4_UP
  Top 0.203: SIGN_CON.9 TEENSY_3.5.15/A1
SCL1  (via drill 0.35)
  Top 0.203: v67.31,83.82 63.5,83.82 57.15,90.17 43.18,90.17 38.1,95.25 27.94,95.25 19.05,86.36 15.24,86.36 12.7,83.82 12.7,77.47 8.89,73.66 6.35,73.66 2.54,69.85 2.54,15.62 | v76.2,87 82.88,87 | 82.88,87 83.06,87 | 83.06,87 83.14,87 | 83.14,87 86.23,87 | 86.36,87 86.23,87 | 86.36,87 86.49,87 | 86.49,87 92.53,87 US_EST.1 | R_SCL1.1 86.36,87.12 | 86.36,87.12 86.36,87 | US_NORD.1 83.01,87.12 | 83.01,87.12 83.01,87.04 83.06,87 | 86.23,87 86.36,87.12 | 86.36,87.12 86.49,87 | 82.88,87 83.01,87.12 | 83.14,87 83.01,87.12 | 2.54,15.62 2.54,15.49 | 2.54,15.49 2.54,15.37 | 2.54,15.37 2.54,8.89 5.08,6.35 8.26,6.35 9.7,4.91 US_SUD.1 | US_OVEST.1 2.67,15.49 | 2.54,15.49 2.67,15.49 | 2.54,15.62 2.67,15.49 | 2.67,15.49 2.54,15.37
  Bottom 0.203: TEENSY_3.5.37/A18 68.58,82.55 | 68.71,82.68 73.03,87 v76.2,87 | 68.71,82.68 68.58,82.55 | 68.58,82.55 68.45,82.68 | 68.45,82.68 v67.31,83.82 | 68.45,82.68 68.71,82.68
SCL_I2C  (via drill 0.35)
  Top 0.203: v45.72,52.07 v41.27,56.52
  Bottom 0.203: TEENSY_3.5.19/A5/SCL 38.1,77.47 36.83,76.2 31.75,76.2 22.86,67.31 20.32,67.31 17.78,64.77 17.78,62.23 19.83,60.18 37.61,60.18 v41.27,56.52 | v45.72,52.07 45.72,39.37 42.55,36.2 42.55,24.77 45.72,21.59 IMU_1.5 45.72,13.97 46.99,12.7 R_SCL.1
SDA1  (via drill 0.35)
  Top 0.203: v72.39,90.17 72.39,92.71 74.93,95.25 80.88,95.25 | 80.88,95.25 81.03,95.25 | 81.03,95.25 81.15,95.25 | US_NORD.2 81.01,95.12 | 81.01,95.12 81.01,95.23 81.03,95.25 | 81.15,95.25 81.03,95.12 81.01,95.12 | 81.01,95.12 80.88,95.25 | 81.15,95.25 82.55,95.25 83.5,96.2 86.68,96.2 87.63,95.25 87.63,90.17 88.63,89.17 88.77,89.17 | US_EST.2 89.03,89.17 | 89.03,89.17 88.9,89.17 | 88.9,89.17 88.77,89.17 | R_SDA1.1 88.9,89.28 | 88.9,89.17 88.9,89.28 | 88.77,89.17 88.88,89.28 88.9,89.28 | 88.9,89.28 88.92,89.28 89.03,89.17
  Bottom 0.203: TEENSY_3.5.38/A19 66.04,82.55 63.5,85.09 | v72.39,90.17 71.12,88.9 67.31,88.9 63.5,85.09 | 63.5,85.09 55.88,92.71 41.91,92.71 38.1,96.52 30.48,96.52 21.59,87.63 17.78,87.63 12.7,82.55 12.7,80.94 12.68,80.92 12.68,76.2 10.13,73.66 5.08,73.66 2.54,71.12 2.54,13.59 | US_SUD.2 11.7,5.45 10.79,6.35 5.08,6.35 2.54,8.89 2.54,13.37 | 2.54,13.59 2.54,13.46 | 2.54,13.46 2.54,13.37 | US_OVEST.2 2.67,13.5 | 2.67,13.5 2.58,13.5 2.54,13.46 | 2.54,13.37 2.67,13.5 | 2.67,13.5 2.58,13.59 2.54,13.59
SDA_I2C  (via drill 0.35)
  Top 0.203: v41.27,59.05 v46.99,53.34
  Bottom 0.203: v41.27,59.05 39.37,60.96 20.32,60.96 19.05,62.23 19.05,64.77 20.32,66.04 22.86,66.04 32.38,75.56 39.37,75.56 40.64,76.83 TEENSY_3.5.18/A4/SDA | v46.99,53.34 46.99,39.37 43.81,36.2 43.81,26.04 48.26,21.59 IMU_1.4 48.26,16.51 49.53,15.24 R_SDA.1
SP1
  Top 0.203: S1.1 47.62,95.12 47.62,96.52 48.9,97.79 53.34,97.79 64.77,86.36 73.66,86.36 81.28,78.74 81.28,68.58 87.63,62.23 87.63,44.45 ARDUINO_PRO_MINI.20
SP2
  Top 0.203: ARDUINO_PRO_MINI.19 88.9,43.18 88.9,62.23 82.55,68.58 82.55,78.74 73.66,87.63 66.04,87.63 63.5,90.17 63.5,91.44 S2.1
SP3
  Top 0.203: S3.1 81.01,85.09 82.55,85.09 86.36,81.28 86.36,78.74 84.38,76.76 84.38,73.1 86.36,71.12 86.36,66.04 90.17,62.23 90.17,41.91 ARDUINO_PRO_MINI.18
SP4
  Top 0.203: ARDUINO_PRO_MINI.17 91.44,40.64 91.44,62.23 88.9,64.77 88.9,67.82 S4.1
SP5
  Top 0.203: ARDUINO_PRO_MINI.16 92.71,39.37 92.71,51.44 93.45,52.18 S5.1
SP6
  Top 0.203: ARDUINO_PRO_MINI.15 88.27,30.48 88.9,31.11 88.9,33.02 90.8,34.92 S6.1
SP7
  Top 0.203: ARDUINO_PRO_MINI.14 87.63,27.94 88.9,26.67 88.9,20.32 87.63,19.05 84.37,19.05 S7.1
SP8
  Top 0.203: ARDUINO_PRO_MINI.13 83.82,25.4 69.88,11.46 S8.1
SP9
  Top 0.203: ARDUINO_PRO_MINI.12 71.12,15.24 64.77,8.89 54.61,8.89 52.18,6.46 S9.1
SP10
  Top 0.203: ARDUINO_PRO_MINI.11 69.85,26.67 69.85,15.24 64.77,10.16 54.61,10.16 53.34,8.89 36.76,8.89 S10.1
SP11
  Top 0.203: S11.1 21,15.24 27.94,15.24 33.02,10.16 53.34,10.16 54.61,11.43 64.77,11.43 68.58,15.24 68.58,29.21 69.85,30.48 ARDUINO_PRO_MINI.10
SP12
  Top 0.203: ARDUINO_PRO_MINI.9 69.85,33.02 67.31,35.56 58.42,35.56 54.61,31.75 43.81,31.75 40.01,35.56 33.02,35.56 31.75,34.29 31.75,22.86 30.48,21.59 19.05,21.59 17.78,22.86 15.24,22.86 13.97,21.59 12.7,21.59 11.43,22.86 11.43,24.62 9.38,26.67 9.38,30.13 S12.1
SP13
  Top 0.203: ARDUINO_PRO_MINI.8 68.58,35.56 67.31,36.83 31.75,36.83 20.95,47.62 4.87,47.62 S13.1
SP14
  Top 0.203: ARDUINO_PRO_MINI.7 31.75,38.1 20.95,48.9 12.06,48.9 10.16,50.8 10.16,59.69 7.62,62.23 7.56,62.23 S14.1
SP15
  Top 0.203: ARDUINO_PRO_MINI.6 68.58,40.64 67.31,39.37 31.75,39.37 20.95,50.16 12.7,50.16 11.43,51.44 11.43,69.85 14.37,72.79 14.37,78.74 S15.1
SP16
  Top 0.203: ARDUINO_PRO_MINI.5 69.85,43.18 67.31,40.64 31.75,40.64 20.95,51.44 13.97,51.44 12.7,52.7 12.7,69.85 16.51,73.66 16.51,77.36 S16.1
SW_DX  (via drill 0.35)
  Top 0.203: 81.28,7.87 81.28,10.16 82.55,11.43 90.17,11.43 97.79,19.05 97.79,54.61 96.52,55.88 v92.71,55.88 | SW_DX.2 81.03,7.62 | 81.03,7.62 81.53,7.62 | 81.53,7.62 R_SW_DX.2 | 81.03,7.62 81.28,7.87 | 81.28,7.87 81.53,7.62 | v86.36,55.88 72.39,55.88 71.12,57.15 TEENSY_3.5.29
  Bottom 0.203: v86.36,55.88 v92.71,55.88
SW_SX  (via drill 0.35)
  Top 0.203: 26.54,5.21 26.04,5.71 26.04,6.99 25.4,7.62 SW_SX.2 | 26.54,5.21 26.67,5.08 | 26.67,5.08 26.8,4.95 | 26.8,4.95 27.94,3.81 R_SW_SX.2 | 26.67,5.08 26.8,5.21 | 26.8,5.21 27.94,6.35 27.94,10.16 29.21,11.43 v29.84,11.43 | 26.54,5.21 26.8,5.21 | 26.8,5.21 26.8,4.95
  Bottom 0.203: TEENSY_3.5.28 68.58,62.23 67.31,60.96 53.34,60.96 41.27,48.9 41.27,18.9 35.08,12.7 31.75,12.7 30.48,11.43 v29.84,11.43
TX2
  Bottom 0.203: TEENSY_3.5.10/CS 48.26,62.23 46.35,60.33 46.35,55.24 36.35,45.24 36.35,21.36 35.56,20.57 U$2.16
TX3
  Bottom 0.203: BLUETOOTH.2 24.77,35.56 24.13,36.2 24.13,39.37 25.4,40.64 29.21,40.64 43.81,55.24 43.81,60.33 43.18,60.96 TEENSY_3.5.8
TX4
  Bottom 0.203: TEENSY_3.5.32/A13 78.74,60.96 73.66,55.88 73.66,51.44 73.03,50.8 ARDUINO_PRO_MINI.2

### Text on the board
tNames: TEENSY 3.5
bNames: SUPPLY_CON